# Altium project STM32.PrjPcb
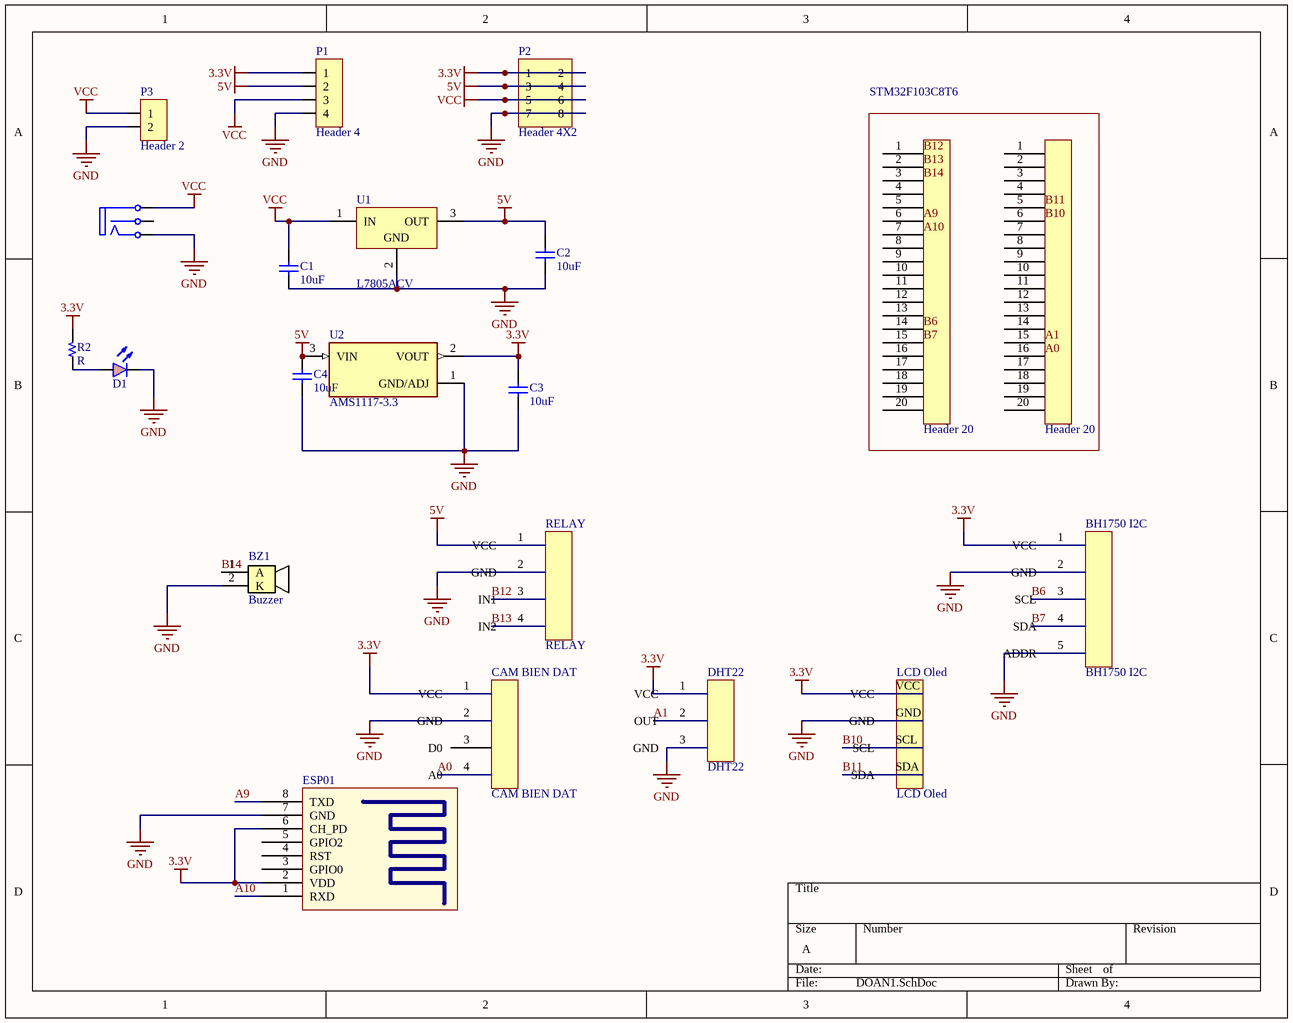
[diagram p0: DOAN1.SchDoc]
2 sheets, 32 parts. Net scope: global (net labels, ports and power ports of the same name join across sheets).
Board files: DOAN1.PcbDoc, Copy of DOAN1.PcbDoc
Sheets:
  DOAN1.SchDoc
  Copy of DOAN1.SchDoc

## Sheet DOAN1.SchDoc
size A; SheetNumber: 1; SheetTotal: 2

### Parts
(Parts that share a designator on the sheet are numbered #1, #2 ... from top to bottom, then left to right.)
1  Header 20  [HDR/Header/20]
2  Header 20  [HDR/Header/20]
BH1750_I2C#1  BH1750 I2C  [HDR/Header/5]
BZ1#1  Buzzer  [BUZZER]
C1  10uF  [CAP Ceramic/W200]
C2  10uF  [CAP Ceramic/W200]
C3  10uF  [CAP Ceramic/W200]
C4  10uF  [CAP Ceramic/W200]
CAM_BIEN_DAT#1  CAM BIEN DAT  [HDR/Header/4]
CON1  CON DC PWR  [CONN/DC/PWR/5.0MM]  (value not drawn)
D1  LED RED  [LED 10MM - RED]  (value not drawn)
DHT22#1  DHT22  [HDR/Header/3]
ESP01#1  Component_1  [ESP8266 ESP-01]  (value not drawn)
LCD_Oled#1  LCD Oled  [HDR/Header/4]
P1  Header 4  [HDR/Header/4]
P2  Header 4X2  [HDR/Header/8/DL]
P3#1  Header 2  [HDR/Terminal/2]
R2  R  [R 1/4W/300]
RELAY#1  RELAY  [HDR/Header/4]
U1  L7805ACV  [PCBComponent_1 - duplicate]
U2  AMS1117-3.3  [SOT229P700X180-4N]

### Sub-sheets
STM32F103C8T6 = File Name (file not in this document): no entries

### Nets
3.3V: BH1750_I2C#1.1(VCC) C3.1 CAM_BIEN_DAT#1.1(VCC) DHT22#1.1(VCC) ESP01#1.2(VDD) ESP01#1.6(CH_PD) LCD_Oled#1.VCC P1.1 P2.1 P2.2 R2.2 U2.2(VOUT)
5V: C2.1 C4.1 P1.2 P2.3 P2.4 RELAY#1.1(VCC) U1.3(OUT) U2.3(VIN)
GND: BH1750_I2C#1.2(GND) BH1750_I2C#1.5(ADDR) BZ1#1.2(K) C1.2 C2.2 C3.2 C4.2 CAM_BIEN_DAT#1.2(GND) CON1.2(T) D1.2(K) DHT22#1.3(GND) ESP01#1.7(GND) LCD_Oled#1.GND P1.4 P2.7 P2.8 P3#1.2 RELAY#1.2(GND) U1.2(GND) U2.1(GND/ADJ)
VCC: C1.1 CON1.3(TN) P1.3 P2.5 P2.6 P3#1.1 U1.1(IN)
A0: 1.16 CAM_BIEN_DAT#1.4(A0)
A1: 1.15 DHT22#1.2(OUT)
A9: 2.6 ESP01#1.8(TXD)
A10: 2.7 ESP01#1.1(RXD)
B6: 2.14 BH1750_I2C#1.3(SCL)
B7: 2.15 BH1750_I2C#1.4(SDA)
B10: 1.6 LCD_Oled#1.SCL
B11: 1.5 LCD_Oled#1.SDA
B12: 2.1 RELAY#1.3(IN1)
B13: 2.2 RELAY#1.4(IN2)
B14: 2.3 BZ1#1.1(A)
NetD1_1: D1.1(A) R2.1

Not connected (* = marked no-connect by the designer): 1 1 2 3 4 7 8 9 10 11 12 13 14 17 18 19 20; 2 4 5 8 9 10 11 12 13 16 17 18 19 20; CAM_BIEN_DAT#1 3(D0); CON1 1(S); ESP01#1 3(GPIO0) 4(RST) 5(GPIO2)

### Library data of the parts
C1-C4 = Capacitor NP: Capacitor non-pol
CON1 = CON DC PWR: DC input connector
D1 = LED RED: Typical LED 3-pin 2-color
P1 = Header 4: Header, 4-Pin
P2 = Header 4X2: Header, 4-Pin, Dual row
P3#1 = Header 2: Header, 2-Pin
R2 = Resistor
U1 = CMP-0244-00484-1: Positive Voltage Regulator, 5V, 3-Pin TO-220; DatasheetVersion: 16/11/2011; ComponentLink2Description: Datasheet; ComponentLink3Description: Package Specification; ComponentLink2URL: http://www.st.com/internet/com/TECHNICAL_RESOURCES/TECHNICAL_LITERATURE/DATASHEET/CD00000444.pdf; PackageDescription: TO, Thru-Hole, Vertical, Heatsink Mounted; 3 In-Line Leads; Pitch 2.54 mm; ComponentLink3URL: http://www.st.com/internet/com/TECHNICAL_RESOURCES/TECHNICAL_LITERATURE/PACKAGE_INFORMATION/CD00004649.pdf; PackageReference: TO220; ComponentLink1URL: http://www.st.com; PackageVersion: ver3.0; ComponentLink1Description: Manufacturer URL
U2 = AMS1117-3.3: Sot223/Pkg 1-Amp 3.3-Volt Low Drop Out Voltage Regulatator; MF: Advanced Monolithic Systems; Package: SOT-223 Seeed Technology; Value: *; Check_prices: https://www.snapeda.com/parts/AMS1117-3.3/Advanced+Monolithic+Systems/view-part/?ref=eda; Price: None; Availability: Not in stock; MP: AMS1117-3.3; SnapEDA_Link: https://www.snapeda.com/parts/AMS1117-3.3/Advanced+Monolithic+Systems/view-part/?ref=snap

## Sheet Copy of DOAN1.SchDoc
size A; SheetNumber: 2; SheetTotal: 2
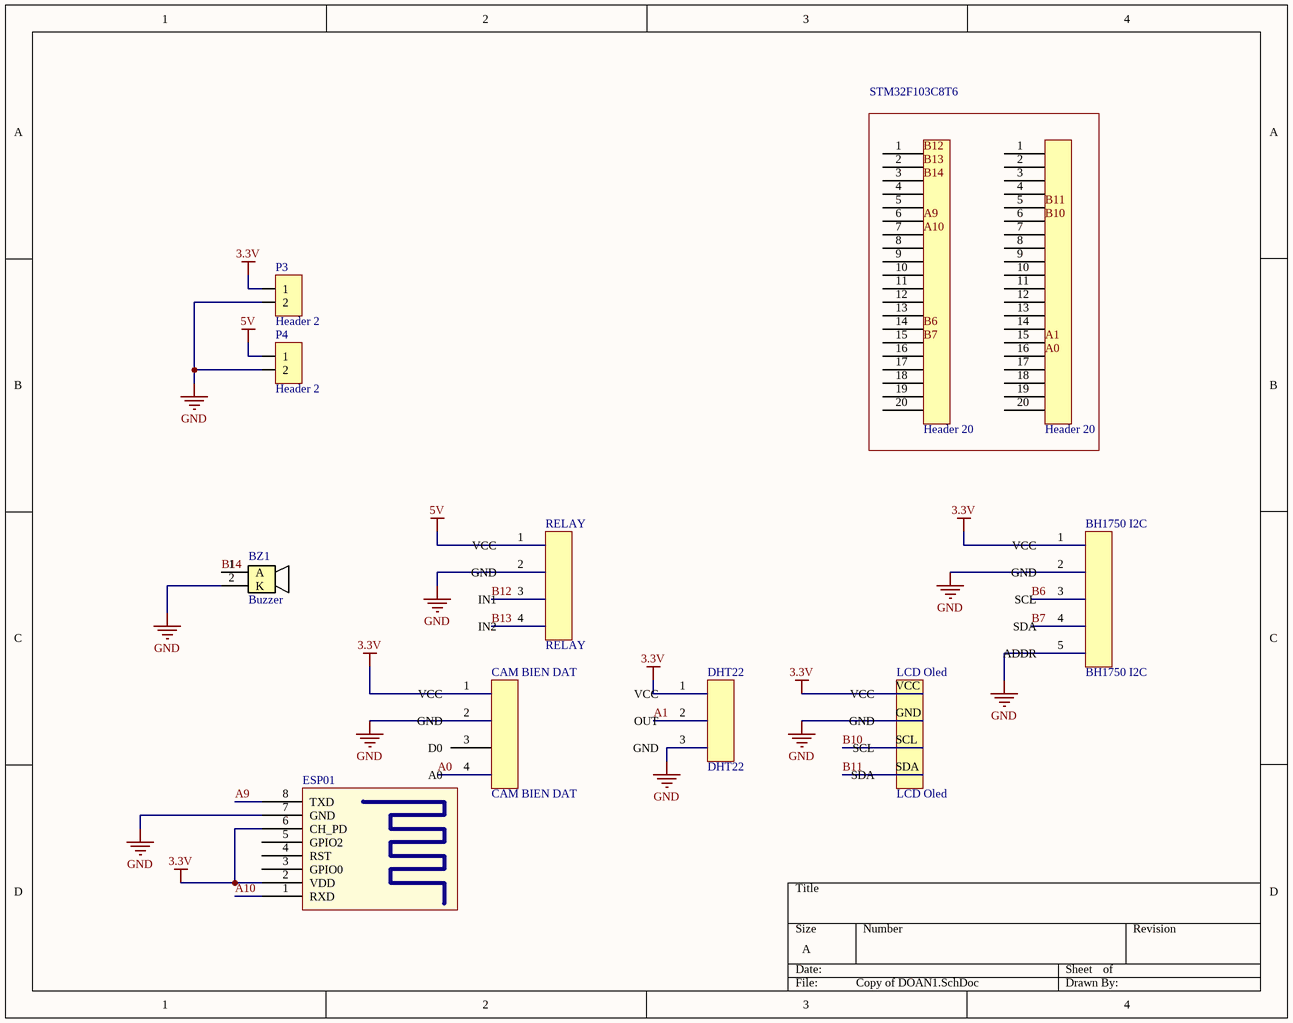
[diagram p1: Copy of DOAN1.SchDoc]

### Parts
(Parts that share a designator on the sheet are numbered #1, #2 ... from top to bottom, then left to right.)
?#1  Header 20  [HDR/Header/20]
?#2  Header 20  [HDR/Header/20]
BH1750_I2C#2  BH1750 I2C  [HDR/Header/5]
BZ1#2  Buzzer  [BUZZER]
CAM_BIEN_DAT#2  CAM BIEN DAT  [HDR/Header/4]
DHT22#2  DHT22  [HDR/Header/3]
ESP01#2  Component_1  [ESP8266 ESP-01]  (value not drawn)
LCD_Oled#2  LCD Oled  [HDR/Header/4]
P3#2  Header 2  [HDR/Header/2]
P4  Header 2  [HDR/Header/2]
RELAY#2  RELAY  [HDR/Header/4]

### Sub-sheets
STM32F103C8T6 = File Name (file not in this document): no entries

### Nets
3.3V: BH1750_I2C#2.1(VCC) CAM_BIEN_DAT#2.1(VCC) DHT22#2.1(VCC) ESP01#2.2(VDD) ESP01#2.6(CH_PD) LCD_Oled#2.VCC P3#2.1
5V: P4.1 RELAY#2.1(VCC)
GND: BH1750_I2C#2.2(GND) BH1750_I2C#2.5(ADDR) BZ1#2.2(K) CAM_BIEN_DAT#2.2(GND) DHT22#2.3(GND) ESP01#2.7(GND) LCD_Oled#2.GND P3#2.2 P4.2 RELAY#2.2(GND)
A0: ?#2.16 CAM_BIEN_DAT#2.4(A0)
A1: ?#2.15 DHT22#2.2(OUT)
A9: ?#1.6 ESP01#2.8(TXD)
A10: ?#1.7 ESP01#2.1(RXD)
B6: ?#1.14 BH1750_I2C#2.3(SCL)
B7: ?#1.15 BH1750_I2C#2.4(SDA)
B10: ?#2.6 LCD_Oled#2.SCL
B11: ?#2.5 LCD_Oled#2.SDA
B12: ?#1.1 RELAY#2.3(IN1)
B13: ?#1.2 RELAY#2.4(IN2)
B14: ?#1.3 BZ1#2.1(A)

Not connected (* = marked no-connect by the designer): ?#1 4 5 8 9 10 11 12 13 16 17 18 19 20; ?#2 1 2 3 4 7 8 9 10 11 12 13 14 17 18 19 20; CAM_BIEN_DAT#2 3(D0); ESP01#2 3(GPIO0) 4(RST) 5(GPIO2)

### Library data of the parts
P3#2 P4 = Header 2: Header, 2-Pin

## Nets that join several sheets
3.3V: DOAN1 (12 pins), Copy of DOAN1 (7 pins)
5V: DOAN1 (8 pins), Copy of DOAN1 (P4.1 RELAY#2.1)
GND: DOAN1 (20 pins), Copy of DOAN1 (10 pins)
A0: DOAN1 (1.16 CAM_BIEN_DAT#1.4), Copy of DOAN1 (?#2.16 CAM_BIEN_DAT#2.4)
A1: DOAN1 (1.15 DHT22#1.2), Copy of DOAN1 (?#2.15 DHT22#2.2)
A9: DOAN1 (2.6 ESP01#1.8), Copy of DOAN1 (?#1.6 ESP01#2.8)
A10: DOAN1 (2.7 ESP01#1.1), Copy of DOAN1 (?#1.7 ESP01#2.1)
B6: DOAN1 (2.14 BH1750_I2C#1.3), Copy of DOAN1 (?#1.14 BH1750_I2C#2.3)
B7: DOAN1 (2.15 BH1750_I2C#1.4), Copy of DOAN1 (?#1.15 BH1750_I2C#2.4)
B10: DOAN1 (1.6 LCD_Oled#1.SCL), Copy of DOAN1 (?#2.6 LCD_Oled#2.SCL)
B11: DOAN1 (1.5 LCD_Oled#1.SDA), Copy of DOAN1 (?#2.5 LCD_Oled#2.SDA)
B12: DOAN1 (2.1 RELAY#1.3), Copy of DOAN1 (?#1.1 RELAY#2.3)
B13: DOAN1 (2.2 RELAY#1.4), Copy of DOAN1 (?#1.2 RELAY#2.4)
B14: DOAN1 (2.3 BZ1#1.1), Copy of DOAN1 (?#1.3 BZ1#2.1)